# Altium schematic sheet imagesensor.SchDoc
size A4; SheetNumber: 10; SheetTotal: 13
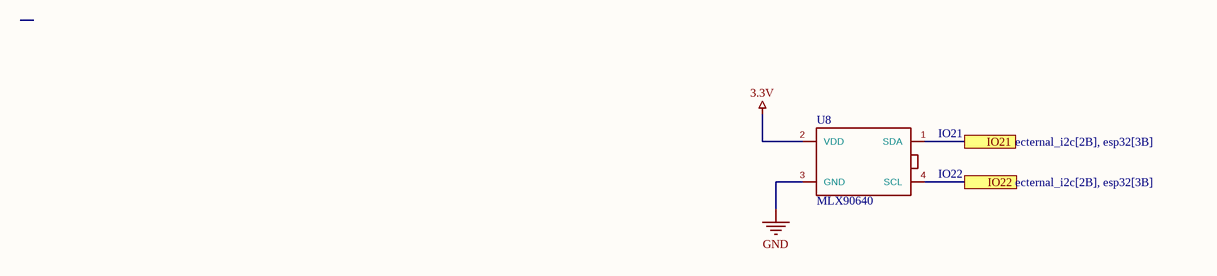
[diagram p0: imagesensor.SchDoc]

## Parts
U8  MLX90640  [FP-MLX90640ESF-BAA-000-TU-MFG]

## Ports
IO21 (see ecternal_i2c[2B], esp32[3B]), IO22 (see ecternal_i2c[2B], esp32[3B])

## Nets
3.3V: U8.2(VDD)
GND: U8.3(GND)
IO21: U8.1(SDA) ; port IO21
IO22: U8.4(SCL) ; port IO22

## Notes on the sheet
- (near U8) IO21
- (near U8) IO22